# Altium schematic sheet [08] SCH-08.SchDoc
size B; DocumentNumber: 8; SheetNumber: 8; SheetTotal: 8
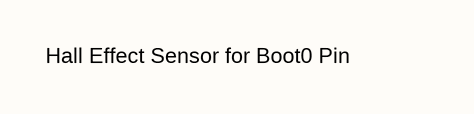
[diagram p0: [08] SCH-08.SchDoc]

## Notes on the sheet
- Hall Effect Sensor for Boot0 Pin
- CONFIDENTIAL INFORMATION
- Size:
- Date:
- B
- Part #:
- Time:
- Rev:
- Sheet
- of
- File: